# Altium schematic sheet gate_driver_array.SchDoc
size A3
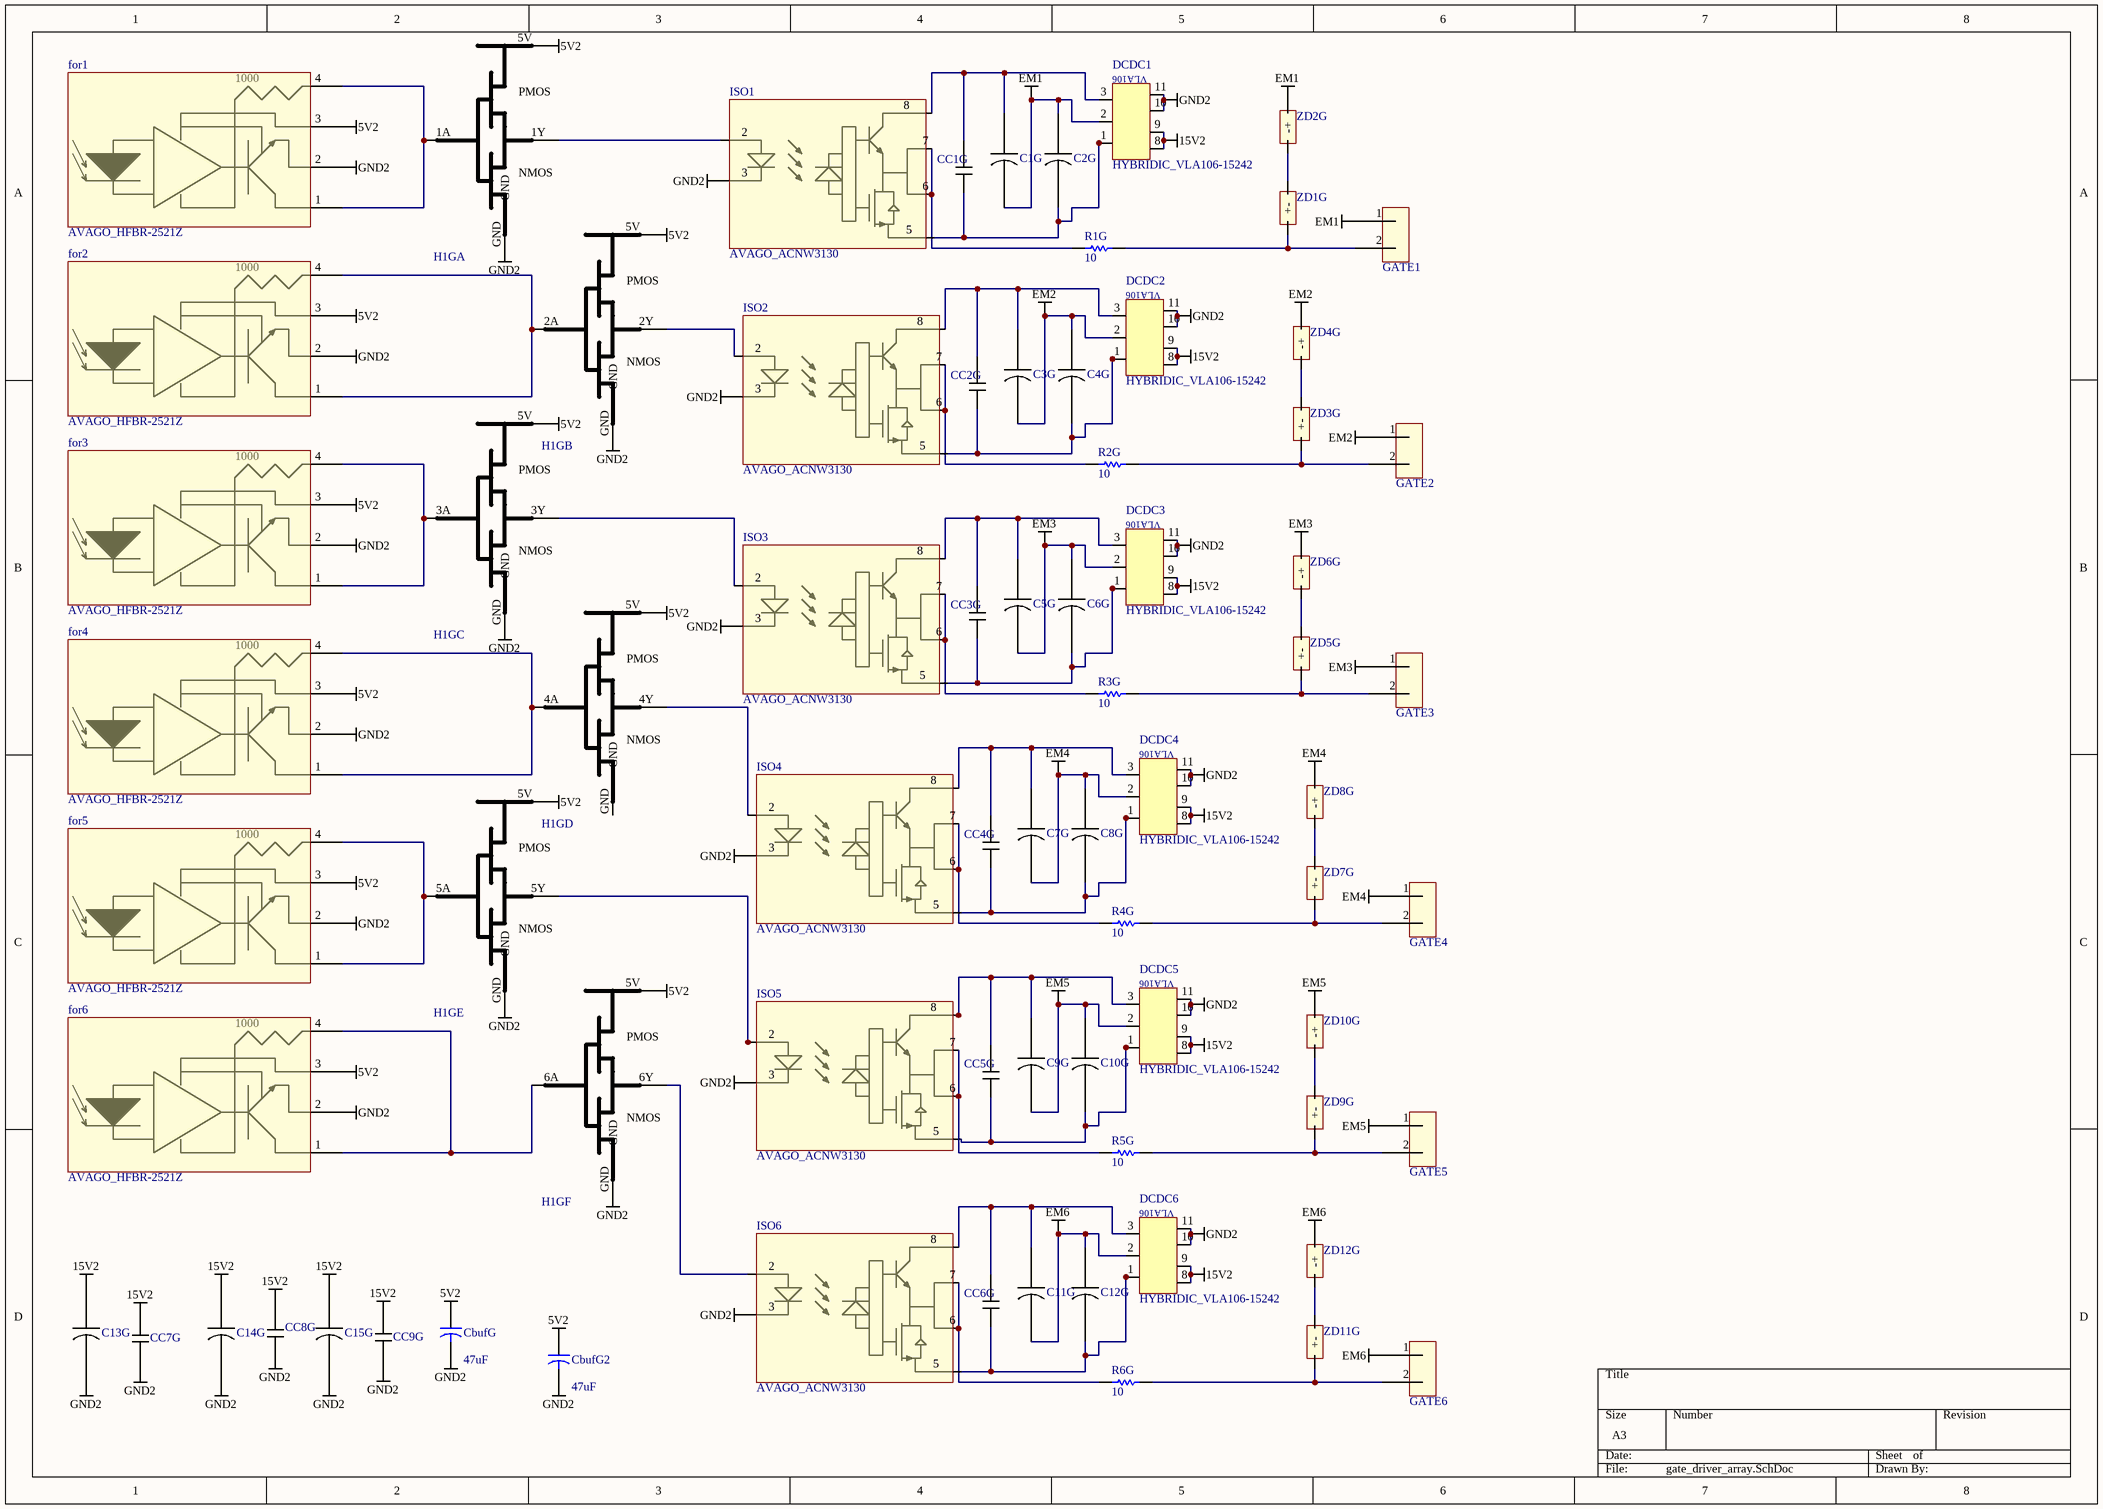
[diagram p0: gate_driver_array.SchDoc]

## Parts
C1G  Cap_Pol_5  [Cap_Pol_5mm]  (value not drawn)
C2G  Cap_Pol_5  [Cap_Pol_5mm]  (value not drawn)
C3G  Cap_Pol_5  [Cap_Pol_5mm]  (value not drawn)
C4G  Cap_Pol_5  [Cap_Pol_5mm]  (value not drawn)
C5G  Cap_Pol_5  [Cap_Pol_5mm]  (value not drawn)
C6G  Cap_Pol_5  [Cap_Pol_5mm]  (value not drawn)
C7G  Cap_Pol_5  [Cap_Pol_5mm]  (value not drawn)
C8G  Cap_Pol_5  [Cap_Pol_5mm]  (value not drawn)
C9G  Cap_Pol_5  [Cap_Pol_5mm]  (value not drawn)
C10G  Cap_Pol_5  [Cap_Pol_5mm]  (value not drawn)
C11G  Cap_Pol_5  [Cap_Pol_5mm]  (value not drawn)
C12G  Cap_Pol_5  [Cap_Pol_5mm]  (value not drawn)
C13G  Cap_Pol_5  [Cap_Pol_5mm]  (value not drawn)
C14G  Cap_Pol_5  [Cap_Pol_5mm]  (value not drawn)
C15G  Cap_Pol_5  [Cap_Pol_5mm]  (value not drawn)
CbufG  value 47uF  [CAPR5-4X5]  (hidden comment: Cap2)
CbufG2  value 47uF  [CAPR5-4X5]  (hidden comment: Cap2)
CC1G  CAP_CERAM_5MM  [CAP_CERAM_5MM]  (value not drawn)
CC2G  CAP_CERAM_5MM  [CAP_CERAM_5MM]  (value not drawn)
CC3G  CAP_CERAM_5MM  [CAP_CERAM_5MM]  (value not drawn)
CC4G  CAP_CERAM_5MM  [CAP_CERAM_5MM]  (value not drawn)
CC5G  CAP_CERAM_5MM  [CAP_CERAM_5MM]  (value not drawn)
CC6G  CAP_CERAM_5MM  [CAP_CERAM_5MM]  (value not drawn)
CC7G  CAP_CERAM_5MM  [CAP_CERAM_5MM]  (value not drawn)
CC8G  CAP_CERAM_5MM  [CAP_CERAM_5MM]  (value not drawn)
CC9G  CAP_CERAM_5MM  [CAP_CERAM_5MM]  (value not drawn)
DCDC1  HYBRIDIC_VLA106-15242  [HYBRIDIC_VLA106-15242]
DCDC2  HYBRIDIC_VLA106-15242  [HYBRIDIC_VLA106-15242]
DCDC3  HYBRIDIC_VLA106-15242  [HYBRIDIC_VLA106-15242]
DCDC4  HYBRIDIC_VLA106-15242  [HYBRIDIC_VLA106-15242]
DCDC5  HYBRIDIC_VLA106-15242  [HYBRIDIC_VLA106-15242]
DCDC6  HYBRIDIC_VLA106-15242  [HYBRIDIC_VLA106-15242]
for1  AVAGO_HFBR-2521Z  [AVAGO_HFBR-2521Z]
for2  AVAGO_HFBR-2521Z  [AVAGO_HFBR-2521Z]
for3  AVAGO_HFBR-2521Z  [AVAGO_HFBR-2521Z]
for4  AVAGO_HFBR-2521Z  [AVAGO_HFBR-2521Z]
for5  AVAGO_HFBR-2521Z  [AVAGO_HFBR-2521Z]
for6  AVAGO_HFBR-2521Z  [AVAGO_HFBR-2521Z]
GATE1  5MM_HOR_ENTRY  [5MM_HOR_ENTRY]  (value not drawn)
GATE2  5MM_HOR_ENTRY  [5MM_HOR_ENTRY]  (value not drawn)
GATE3  5MM_HOR_ENTRY  [5MM_HOR_ENTRY]  (value not drawn)
GATE4  5MM_HOR_ENTRY  [5MM_HOR_ENTRY]  (value not drawn)
GATE5  5MM_HOR_ENTRY  [5MM_HOR_ENTRY]  (value not drawn)
GATE6  5MM_HOR_ENTRY  [5MM_HOR_ENTRY]  (value not drawn)
H1G  TI_SN74HC04N  [SN74HC04N]  (value not drawn)  (parts A,B,C,D,E,F of 7)
ISO1  AVAGO_ACNW3130  [AVAGO_ACNW3130]
ISO2  AVAGO_ACNW3130  [AVAGO_ACNW3130]
ISO3  AVAGO_ACNW3130  [AVAGO_ACNW3130]
ISO4  AVAGO_ACNW3130  [AVAGO_ACNW3130]
ISO5  AVAGO_ACNW3130  [AVAGO_ACNW3130]
ISO6  AVAGO_ACNW3130  [AVAGO_ACNW3130]
R1G  value 10  [AXIAL-0.3]  (hidden comment: Res1)
R2G  value 10  [AXIAL-0.3]  (hidden comment: Res1)
R3G  value 10  [AXIAL-0.3]  (hidden comment: Res1)
R4G  value 10  [AXIAL-0.3]  (hidden comment: Res1)
R5G  value 10  [AXIAL-0.3]  (hidden comment: Res1)
R6G  value 10  [AXIAL-0.3]  (hidden comment: Res1)
ZD1G  ZENER_1W  [ZENER_1W]  (value not drawn)
ZD2G  ZENER_1W  [ZENER_1W]  (value not drawn)
ZD3G  ZENER_1W  [ZENER_1W]  (value not drawn)
ZD4G  ZENER_1W  [ZENER_1W]  (value not drawn)
ZD5G  ZENER_1W  [ZENER_1W]  (value not drawn)
ZD6G  ZENER_1W  [ZENER_1W]  (value not drawn)
ZD7G  ZENER_1W  [ZENER_1W]  (value not drawn)
ZD8G  ZENER_1W  [ZENER_1W]  (value not drawn)
ZD9G  ZENER_1W  [ZENER_1W]  (value not drawn)
ZD10G  ZENER_1W  [ZENER_1W]  (value not drawn)
ZD11G  ZENER_1W  [ZENER_1W]  (value not drawn)
ZD12G  ZENER_1W  [ZENER_1W]  (value not drawn)

## Nets
5V2: CbufG.1 CbufG2.1 for1.3 for2.3 for3.3 for4.3 for5.3 for6.3 H1G.5V
15V2: C13G.1 C14G.1 C15G.1 CC7G.2 CC8G.1 CC9G.2 DCDC1.8 DCDC1.9 DCDC2.8 DCDC2.9 DCDC3.8 DCDC3.9 DCDC4.8 DCDC4.9 DCDC5.8 DCDC5.9 DCDC6.8 DCDC6.9
EM1: C1G.2 C2G.1 DCDC1.2 GATE1.1 ZD2G.1(+)
EM2: C3G.2 C4G.1 DCDC2.2 GATE2.1 ZD4G.1(+)
EM3: C5G.2 C6G.1 DCDC3.2 GATE3.1 ZD6G.1(+)
EM4: C7G.2 C8G.1 DCDC4.2 GATE4.1 ZD8G.1(+)
EM5: C9G.2 C10G.1 DCDC5.2 GATE5.1 ZD10G.1(+)
EM6: C11G.2 C12G.1 DCDC6.2 GATE6.1 ZD12G.1(+)
GND2: C13G.2 C14G.2 C15G.2 CbufG.2 CbufG2.2 CC7G.1 CC8G.2 CC9G.1 DCDC1.10 DCDC1.11 DCDC2.10 DCDC2.11 DCDC3.10 DCDC3.11 DCDC4.10 DCDC4.11 DCDC5.10 DCDC5.11 DCDC6.10 DCDC6.11 for1.2 for2.2 for3.2 for4.2 for5.2 for6.2 H1G.GND ISO1.3 ISO2.3 ISO3.3 ISO4.3 ISO5.3 ISO6.3
NetC1G_1: C1G.1 CC1G.1 DCDC1.3 ISO1.8
NetC2G_2: C2G.2 CC1G.2 DCDC1.1 ISO1.5
NetC3G_1: C3G.1 CC2G.1 DCDC2.3 ISO2.8
NetC4G_2: C4G.2 CC2G.2 DCDC2.1 ISO2.5
NetC5G_1: C5G.1 CC3G.1 DCDC3.3 ISO3.8
NetC6G_2: C6G.2 CC3G.2 DCDC3.1 ISO3.5
NetC7G_1: C7G.1 CC4G.1 DCDC4.3 ISO4.8
NetC8G_2: C8G.2 CC4G.2 DCDC4.1 ISO4.5
NetC9G_1: C9G.1 CC5G.1 DCDC5.3 ISO5.8
NetC10G_2: C10G.2 CC5G.2 DCDC5.1 ISO5.5
NetC11G_1: C11G.1 CC6G.1 DCDC6.3 ISO6.8
NetC12G_2: C12G.2 CC6G.2 DCDC6.1 ISO6.5
Netfor1_1: for1.1 for1.4 H1G.1A
Netfor2_1: for2.1 for2.4 H1G.2A
Netfor3_1: for3.1 for3.4 H1G.3A
Netfor4_1: for4.1 for4.4 H1G.4A
Netfor5_1: for5.1 for5.4 H1G.5A
Netfor6_1: for6.1 for6.4 H1G.6A
NetGATE1_2: GATE1.2 R1G.2 ZD1G.1(+)
NetGATE2_2: GATE2.2 R2G.2 ZD3G.1(+)
NetGATE3_2: GATE3.2 R3G.2 ZD5G.1(+)
NetGATE4_2: GATE4.2 R4G.2 ZD7G.1(+)
NetGATE5_2: GATE5.2 R5G.2 ZD9G.1(+)
NetGATE6_2: GATE6.2 R6G.2 ZD11G.1(+)
NetH1G_1Y: H1G.1Y ISO1.2
NetH1G_2Y: H1G.2Y ISO2.2
NetH1G_3Y: H1G.3Y ISO3.2
NetH1G_4Y: H1G.4Y ISO4.2
NetH1G_5Y: H1G.5Y ISO5.2
NetH1G_6Y: H1G.6Y ISO6.2
NetISO1_6: ISO1.6 ISO1.7 R1G.1
NetISO2_6: ISO2.6 ISO2.7 R2G.1
NetISO3_6: ISO3.6 ISO3.7 R3G.1
NetISO4_6: ISO4.6 ISO4.7 R4G.1
NetISO5_6: ISO5.6 ISO5.7 R5G.1
NetISO6_6: ISO6.6 ISO6.7 R6G.1
NetZD1G_2: ZD1G.2(-) ZD2G.2(-)
NetZD3G_2: ZD3G.2(-) ZD4G.2(-)
NetZD5G_2: ZD5G.2(-) ZD6G.2(-)
NetZD7G_2: ZD7G.2(-) ZD8G.2(-)
NetZD9G_2: ZD9G.2(-) ZD10G.2(-)
NetZD11G_2: ZD11G.2(-) ZD12G.2(-)

## Notes on the sheet
- (in symbol AVAGO_HFBR-2521Z) 1000
- (in symbol HYBRIDIC_VLA106-15242) VLA106
- (in symbol TI_SN74HC04N, part A) PMOS; NMOS
- (in symbol TI_SN74HC04N, part B) PMOS; NMOS
- (in symbol TI_SN74HC04N, part C) PMOS; NMOS
- (in symbol TI_SN74HC04N, part D) PMOS; NMOS
- (in symbol TI_SN74HC04N, part E) PMOS; NMOS
- (in symbol TI_SN74HC04N, part F) PMOS; NMOS

## Library data of the parts
C1G = Cap_Pol_5: Capacitance: 390uF
CbufG CbufG2 = Cap2: Capacitor; Published: 23-Sep-2002; PackageReference: CAPR5-4X5; Publisher: Altium Limited; PackageDescription: Capacitor; 2 Leads
DCDC1-DCDC6 = HYBRIDIC_VLA106-15242: Isolated DC/DC Converter
for1-for6 = AVAGO_HFBR-2521Z: Optical Fiber Receiver
H1G = TI_SN74HC04N: Hex Inverter 5V
ISO1-ISO6 = AVAGO_ACNW3130: IGBT Gate Drive Optocoupler
R1G R2G R3G R4G R5G R6G = Res1: Resistor; Published: 8-Jun-2000; LatestRevisionDate: 17-Jul-2002; LatestRevisionNote: Re-released for DXP Platform.; PackageReference: AXIAL-0.3; Publisher: Altium Limited; PackageDescription: Axial Device, Thru-Hole; 2 Leads; 0.3 in Pin Spacing